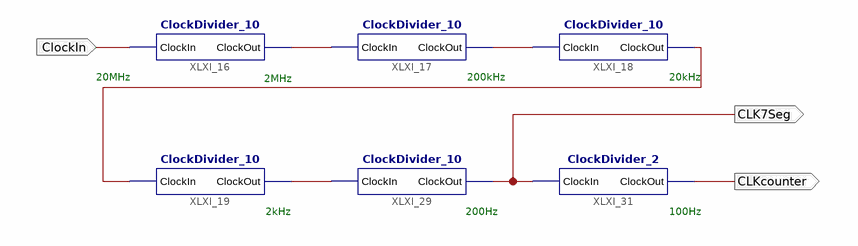
[diagram p0: schematic sheet 1]
// Xilinx ISE schematic ClockDivider.sch (spartan6) as structural Verilog: 6 symbols, 3 ports
module ClockDivider (
  input  ClockIn,
  output CLK7Seg,
  output CLKcounter
);

  wire XLXN_25, XLXN_26, XLXN_27, XLXN_42;

  ClockDivider_10 XLXI_16 (.ClockIn(ClockIn), .ClockOut(XLXN_25));
  ClockDivider_10 XLXI_17 (.ClockIn(XLXN_25), .ClockOut(XLXN_26));
  ClockDivider_10 XLXI_18 (.ClockIn(XLXN_26), .ClockOut(XLXN_27));
  ClockDivider_10 XLXI_19 (.ClockIn(XLXN_27), .ClockOut(XLXN_42));
  ClockDivider_10 XLXI_29 (.ClockIn(XLXN_42), .ClockOut(CLK7Seg));
  ClockDivider_2 XLXI_31 (.ClockIn(CLK7Seg), .ClockOut(CLKcounter));

  // Notes on the sheet:
  //   20MHz
  //   200kHz
  //   20kHz
  //   2MHz
  //   2kHz
  //   200Hz
  //   100Hz
endmodule
